# EAGLE schematic Circular Connector (EAGLE 6.6.0)
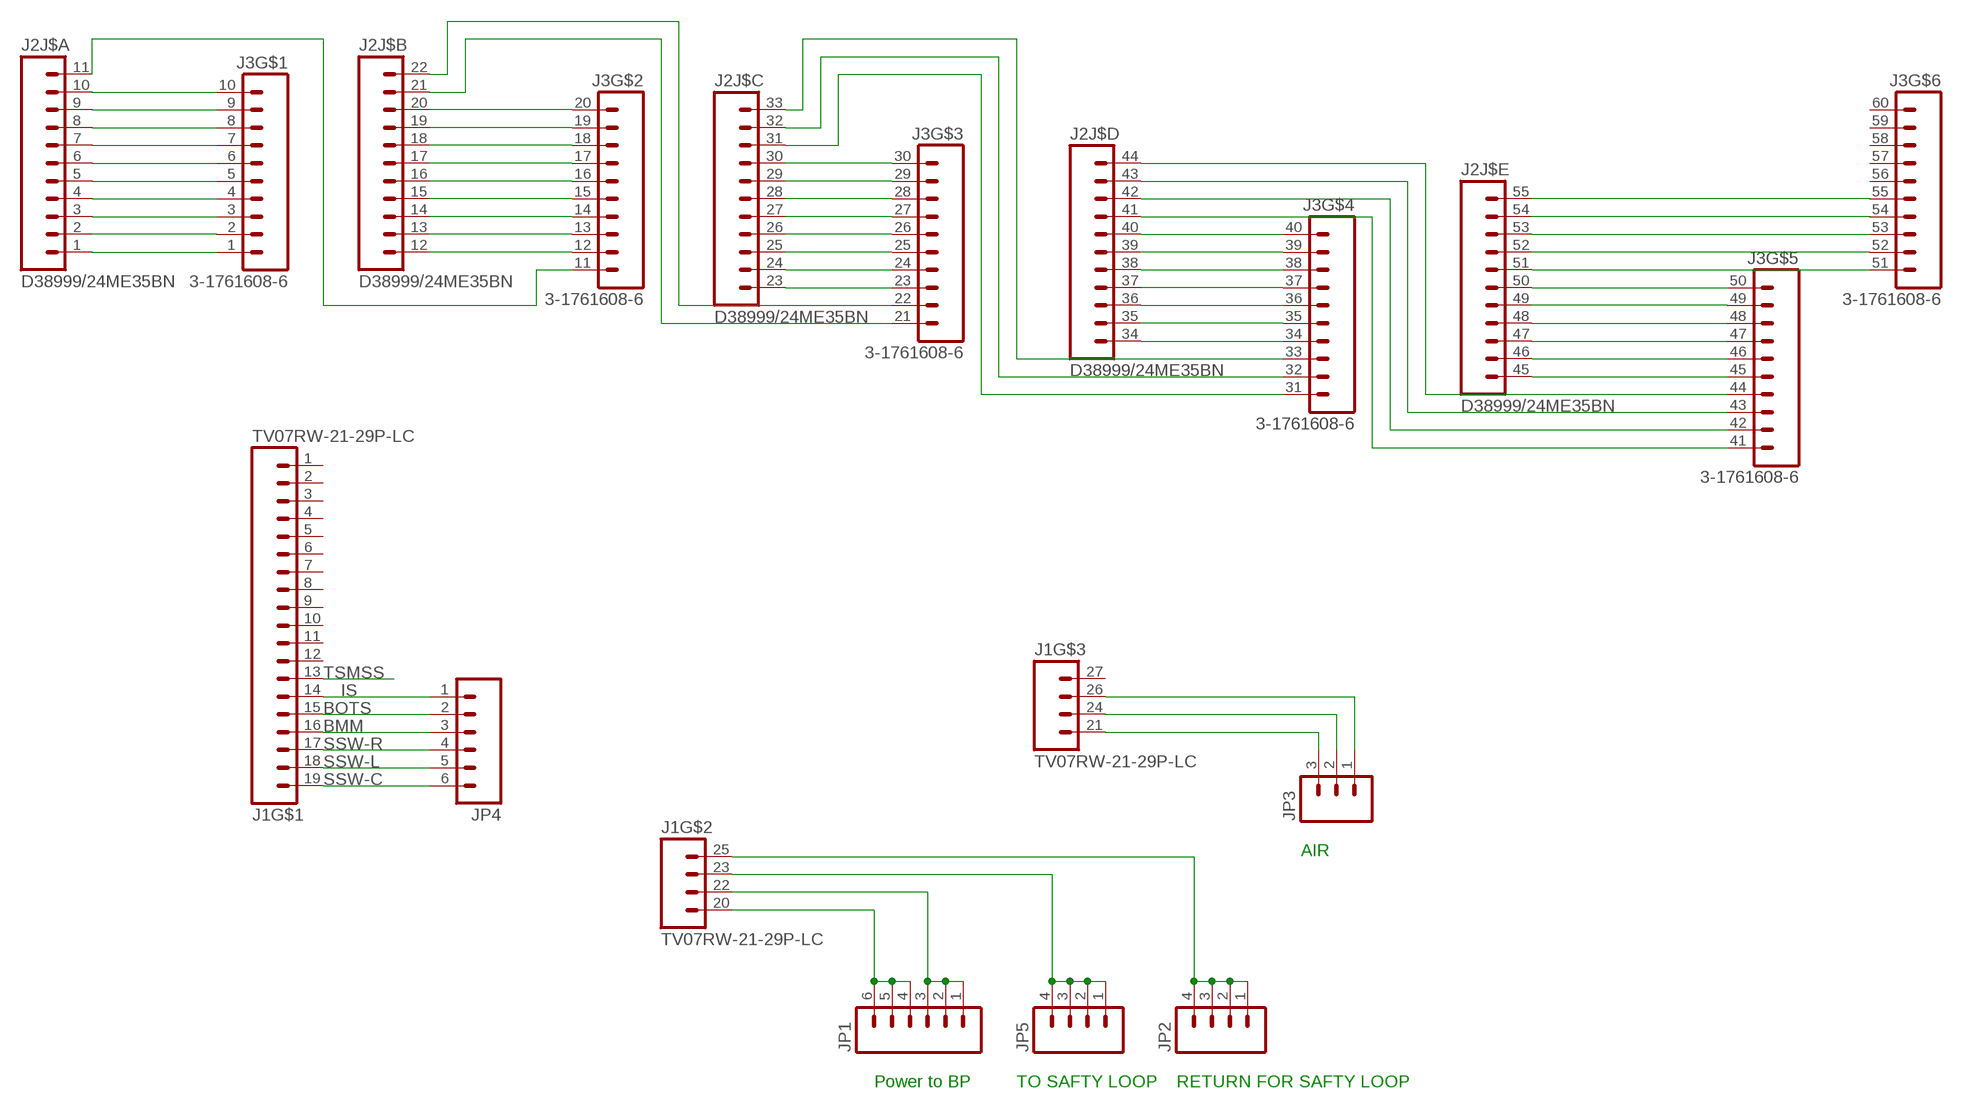
[diagram p0: schematic, sheet 1]

## Parts
J1  TV07RW-21-29P-LC  [TV07RW-21-29P-LC]
J2  D38999/24ME35BN  [D38999/24ME35BN]
J3  3-1761608-6  [3-1761608-6]
JP1  M06POLAR_LOCK  [MOLEX-1X6_LOCK]
JP2  M04POLAR_LOCK  [MOLEX-1X4_LOCK]
JP3  M03POLAR_LOCK  [MOLEX-1X3_LOCK]
JP4  M06POLAR_LOCK  [MOLEX-1X6_LOCK]
JP5  M04POLAR_LOCK  [MOLEX-1X4_LOCK]

## Nets
BMM: JP4.3
BOTS: JP4.2
IS: J1.14 JP4.1
N$1: J2.1 J3.1
N$2: J2.2 J3.2
N$3: J2.3 J3.3
N$4: J2.4 J3.4
N$5: J2.5 J3.5
N$6: J2.6 J3.6
N$7: J2.7 J3.7
N$8: J2.8 J3.8
N$9: J2.9 J3.9
N$10: J2.10 J3.10
N$11: J2.11 J3.11
N$12: J2.12 J3.12
N$13: J2.13 J3.13
N$14: J2.14 J3.14
N$15: J2.15 J3.15
N$16: J2.16 J3.16
N$17: J2.17 J3.17
N$18: J2.18 J3.18
N$19: J2.19 J3.19
N$20: J2.20 J3.20
N$21: J2.21 J3.21
N$22: J2.22 J3.22
N$23: J2.23 J3.23
N$24: J2.24 J3.24
N$25: J2.25 J3.25
N$26: J2.26 J3.26
N$27: J2.27 J3.27
N$28: J2.28 J3.28
N$29: J2.29 J3.29
N$30: J2.30 J3.30
N$31: J2.31 J3.31
N$32: J2.32 J3.32
N$33: J2.33 J3.33
N$34: J2.34 J3.34
N$35: J2.35 J3.35
N$36: J2.36 J3.36
N$37: J2.37 J3.37
N$38: J2.38 J3.38
N$39: J2.39 J3.39
N$40: J2.40 J3.40
N$41: J2.41 J3.41
N$42: J2.42 J3.42
N$43: J2.43 J3.43
N$44: J2.44 J3.44
N$45: J2.45 J3.45
N$46: J2.46 J3.46
N$47: J2.47 J3.47
N$48: J2.48 J3.48
N$49: J2.49 J3.49
N$50: J2.50 J3.50
N$51: J2.51 J3.51
N$52: J2.52 J3.52
N$53: J2.53 J3.53
N$54: J2.54 J3.54
N$55: J2.55 J3.55
N$56: J1.20 JP1.4 JP1.5 JP1.6
N$57: J1.22 JP1.1 JP1.2 JP1.3
N$58: J1.25 JP2.1 JP2.2 JP2.3 JP2.4
N$59: J1.21 JP3.3
N$60: J1.24 JP3.2
N$61: J1.26 JP3.1
N$63: J1.23 JP5.1 JP5.2 JP5.3 JP5.4
SSW-C: J1.19 JP4.6
SSW-L: JP4.5
SSW-R: JP4.4
TSMSS: J1.13
Unconnected: J1.1 J1.2 J1.3 J1.4 J1.5 J1.6 J1.7 J1.8 J1.9 J1.10 J1.11 J1.12 J1.15 J1.16 J1.17 J1.18 J1.27 J3.56 J3.57 J3.58 J3.59 J3.60

## Notes on the sheet
- AIR
- Power to BP | TO SAFTY LOOP | RETURN FOR SAFTY LOOP

## Library data of the parts
J1 = FSAE Eletric (1):TV07RW-21-29P-LC
J2 = FSAE Eletric (1):D38999/24ME35BN
J3 = FSAE Eletric:3-1761608-6
JP1 JP4 = SparkFun-Connectors:M06: Header 6 Standard 6-pin 0.1" header. Use with straight break away headers (SKU : PRT-00116), right angle break away headers (PRT-00553), swiss pins (PRT-00743), machine pins (PRT-00117), and female headers (PRT-00115). Molex polarized connector foot print use with SKU : PRT-08094 with associated crimp pins and housings. NOTES ON THE VARIANTS LOCK and LOCK_LONGPADS... This footprint was designed to help hold the alignment of a through-hole component (i.e. 6-pin header) while soldering it into place. You may notice that each hole has been shifted either up or down by 0.005 of an inch from it's more standard position (which is a perfectly straight line). This slight alteration caused the pins (the squares in the middle) to touch the edges of the holes. Because they are alternating, it causes a "brace" to hold the component in place. 0.005 has proven to be the perfect amount of "off-center" position when using our standard breakaway headers. Although looks a little odd when you look at the bare footprint, once you have a header in there, the alteration is very hard to notice. Also,if you push a header all the way into place, it is covered up entirely on the bottom side. This idea of altering the position of holes to aid alignment will be further integrated into the Sparkfun Library for other footprints. It can help hold any component with 3 or more connection pins.
JP2 JP5 = SparkFun-Connectors:M04: Header 4 Standard 4-pin 0.1" header. Use with straight break away headers (SKU : PRT-00116), right angle break away headers (PRT-00553), swiss pins (PRT-00743), machine pins (PRT-00117), and female headers (PRT-00115). Molex polarized connector foot print use with SKU : PRT-08231 with associated crimp pins and housings. 1MM SMD Version SKU: PRT-10208
JP3 = SparkFun-Connectors:M03: Header 3 Standard 3-pin 0.1" header. Use with straight break away headers (SKU : PRT-00116), right angle break away headers (PRT-00553), swiss pins (PRT-00743), machine pins (PRT-00117), and female headers (PRT-00115). Molex polarized connector foot print use with SKU : PRT-08232 with associated crimp pins and housings.